# Altium schematic sheet Sheet3.SchDoc
size A3; SPICEModelCacheKOLHZRAH: <root> / <DocumentId>KOLHZRAH</DocumentId> / </root>
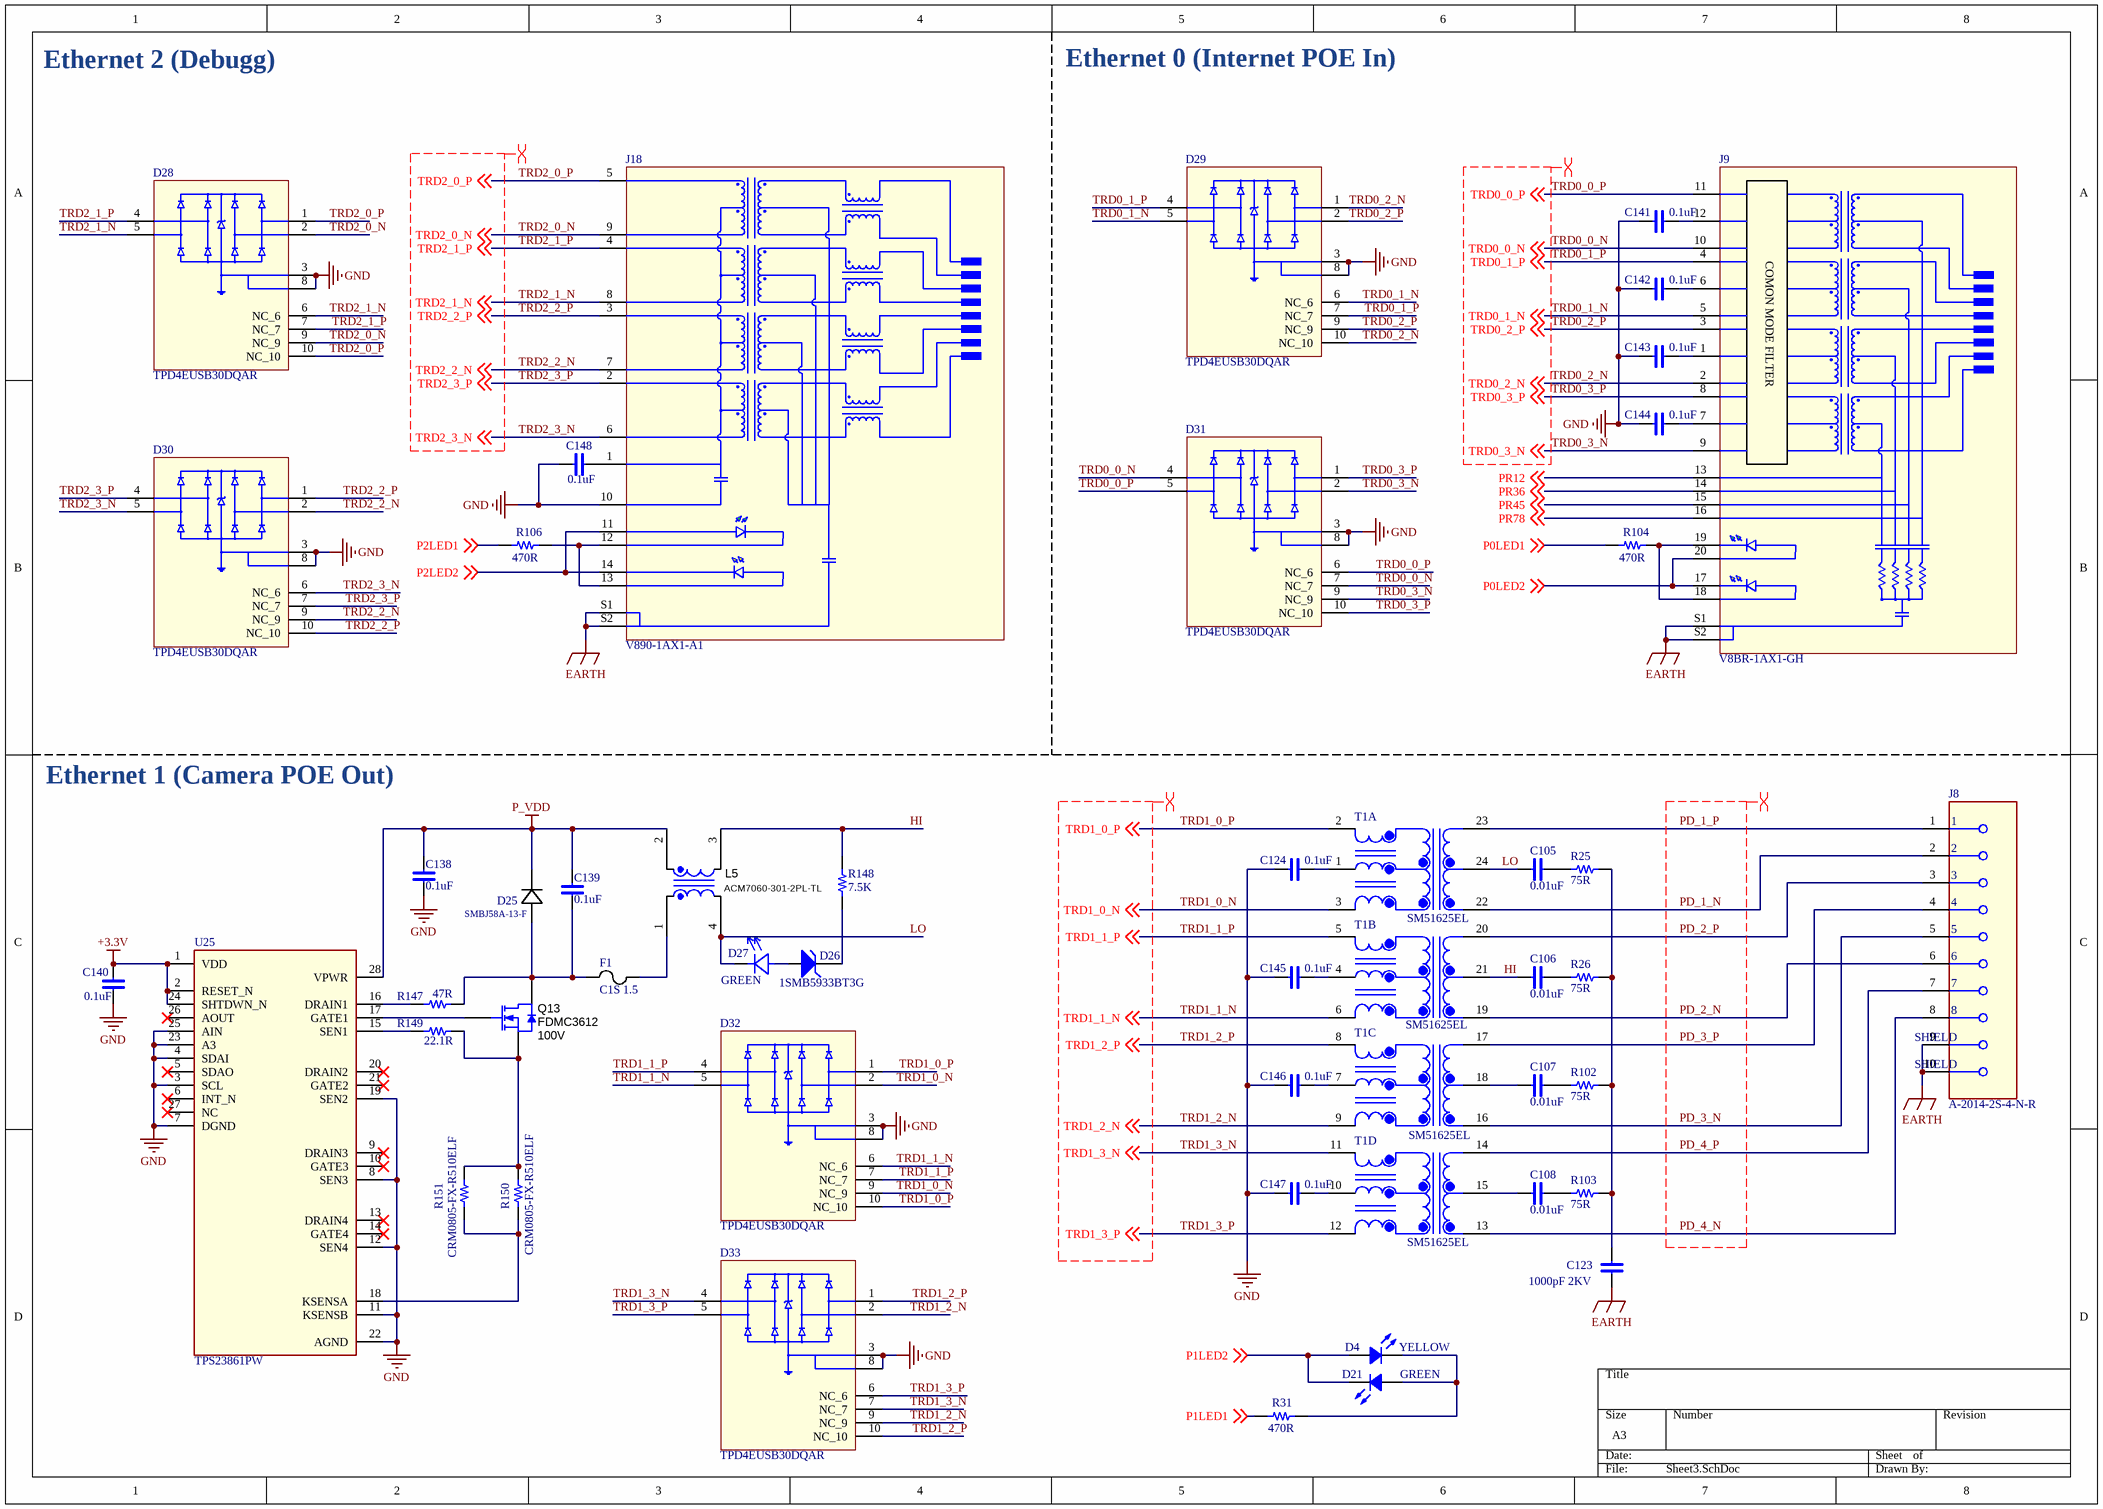
[diagram p0: Sheet3.SchDoc]

## Parts
C105  0.01uF  [C-0402/1005]
C106  0.01uF  [C-0402/1005]
C107  0.01uF  [C-0402/1005]
C108  0.01uF  [C-0402/1005]
C123  1000pF 2KV  [C-0402/1005]
C124  0.1uF  [C-0402/1005]
C138  0.1uF  [C-0402/1005]
C139  0.1uF  [C-0402/1005]
C140  0.1uF  [C-0402/1005]
C141  0.1uF  [C-0402/1005]
C142  0.1uF  [C-0402/1005]
C143  0.1uF  [C-0402/1005]
C144  0.1uF  [C-0402/1005]
C145  0.1uF  [C-0402/1005]
C146  0.1uF  [C-0402/1005]
C147  0.1uF  [C-0402/1005]
C148  0.1uF  [C-0402/1005]
D4  YELLOW  [LED-0603-RED]
D21  GREEN  [LED-0603-RED]
D25  SMBJ58A-13-F  [CR_SM12CA-13-F_DIO]
D26  1SMB5933BT3G  [ONSC-SMB-2-403A-03_H_V]
D27  GREEN  [LED-0603-Green]
D28  TPD4EUSB30DQAR  [IC_TPD4EUSB30DQAR]
D29  TPD4EUSB30DQAR  [IC_TPD4EUSB30DQAR]
D30  TPD4EUSB30DQAR  [IC_TPD4EUSB30DQAR]
D31  TPD4EUSB30DQAR  [IC_TPD4EUSB30DQAR]
D32  TPD4EUSB30DQAR  [IC_TPD4EUSB30DQAR]
D33  TPD4EUSB30DQAR  [IC_TPD4EUSB30DQAR]
F1  C1S 1.5  [C1_BEL]
J8  A-2014-2S-4-N-R  [ASSMANN_A-2014-2S-4-N-R]
J9  V8BR-1AX1-GH  [V8BR1AX1GH]
J18  V890-1AX1-A1  [BEL_V890-1AX1-A1]
L5  ACM7060-301-2PL-TL  [IND_ACM7060_TDK]
Q13  FDMC3612  value 100V  [MLP8_3P3X3P3_ONS]
R25  75R  [R-0402/1005]
R26  75R  [R-0402/1005]
R31  470R  [R-0402/1005]
R102  75R  [R-0402/1005]
R103  75R  [R-0402/1005]
R104  470R  [R-0402/1005]
R106  470R  [R-0402/1005]
R147  47R  [R-0402/1005]
R148  7.5K  [R-0805/2012]
R149  22.1R  [R-0402/1005]
R150  CRM0805-FX-R510ELF  [R-0805/2012]
R151  CRM0805-FX-R510ELF  [R-0805/2012]
T1  SM51625EL  [XFMR_SM51625EL]  (parts A,B,C,D of 4)
U25  TPS23861PW  [PW0028A_N]

## Nets
+3.3V: C140.1 U25.1(VDD) U25.2(RESET_N) U25.24(SHTDWN_N)
EARTH: C123.2 J8.9(MNT_1) J8.10(MNT_2) J9.S1(SHIELD) J9.S2(SHIELD) J18.S1(SHIELD) J18.S2(SHIELD)
GND: C124.1 C138.2 C140.2 C141.1 C142.1 C143.1 C144.1 C145.1 C146.1 C147.1 C148.1 D28.3(GND_3) D28.8(GND_8) D29.3(GND_3) D29.8(GND_8) D30.3(GND_3) D30.8(GND_8) D31.3(GND_3) D31.8(GND_8) D32.3(GND_3) D32.8(GND_8) D33.3(GND_3) D33.8(GND_8) J18.10(GND) U25.3(SCL) U25.4(SDAI) U25.7(DGND) U25.8(SEN3) U25.11(KSENSB) U25.12(SEN4) U25.19(SEN2) U25.22(AGND) U25.23(A3) U25.25(AIN)
P_VDD: C138.1 C139.1 D25.1 L5.2 U25.28(VPWR)
HI: C106.1 L5.3 R148.2 T1.21(MCT2)
LO: C105.1 D27.2 L5.4 T1.24(MCT1)
P0LED1: R104.1 ; off-sheet P0LED1
P0LED2: J9.17 J9.20 ; off-sheet P0LED2
P1LED1: R31.1 ; off-sheet P1LED1
P1LED2: D4.1 D21.2 ; off-sheet P1LED2
P2LED1: R106.1 ; off-sheet P2LED1
P2LED2: J18.11 J18.14 ; off-sheet P2LED2
PD_1_N: J8.2 T1.22(MX1-)
PD_1_P: J8.1 T1.23(MX1+)
PD_2_N: J8.6 T1.19(MX2-)
PD_2_P: J8.3 T1.20(MX2+)
PD_3_N: J8.5 T1.16(MX3-)
PD_3_P: J8.4 T1.17(MX3+)
PD_4_N: J8.8 T1.13(MX4-)
PD_4_P: J8.7 T1.14(MX4+)
PR12: J9.13(VC12) ; off-sheet PR12
PR36: J9.14(VC36) ; off-sheet PR36
PR45: J9.15(VC45) ; off-sheet PR45
PR78: J9.16(VC78) ; off-sheet PR78
TRD0_0_N: D31.4(D2+) D31.7(NC_7) J9.10(TRD1-) ; off-sheet TRD0_0_N
TRD0_0_P: D31.5(D2-) D31.6(NC_6) J9.11(TRD1+) ; off-sheet TRD0_0_P
TRD0_1_N: D29.5(D2-) D29.6(NC_6) J9.5(TRD2-) ; off-sheet TRD0_1_N
TRD0_1_P: D29.4(D2+) D29.7(NC_7) J9.4(TRD2+) ; off-sheet TRD0_1_P
TRD0_2_N: D29.1(D1+) D29.10(NC_10) J9.2(TRD3-) ; off-sheet TRD0_2_N
TRD0_2_P: D29.2(D1-) D29.9(NC_9) J9.3(TRD3+) ; off-sheet TRD0_2_P
TRD0_3_N: D31.2(D1-) D31.9(NC_9) J9.9(TRD4-) ; off-sheet TRD0_3_N
TRD0_3_P: D31.1(D1+) D31.10(NC_10) J9.8(TRD4+) ; off-sheet TRD0_3_P
TRD1_0_N: D32.2(D1-) D32.9(NC_9) T1.3(TD1-) ; off-sheet TRD1_0_N
TRD1_0_P: D32.1(D1+) D32.10(NC_10) T1.2(TD1+) ; off-sheet TRD1_0_P
TRD1_1_N: D32.5(D2-) D32.6(NC_6) T1.6(TD2-) ; off-sheet TRD1_1_N
TRD1_1_P: D32.4(D2+) D32.7(NC_7) T1.5(TD2+) ; off-sheet TRD1_1_P
TRD1_2_N: D33.2(D1-) D33.9(NC_9) T1.9(TD3-) ; off-sheet TRD1_2_N
TRD1_2_P: D33.1(D1+) D33.10(NC_10) T1.8(TD3+) ; off-sheet TRD1_2_P
TRD1_3_N: D33.4(D2+) D33.7(NC_7) T1.11(TD4+) ; off-sheet TRD1_3_N
TRD1_3_P: D33.5(D2-) D33.6(NC_6) T1.12(TD4-) ; off-sheet TRD1_3_P
TRD2_0_N: D28.2(D1-) D28.9(NC_9) J18.9(TRD1-) ; off-sheet TRD2_0_N
TRD2_0_P: D28.1(D1+) D28.10(NC_10) J18.5(TRD1+) ; off-sheet TRD2_0_P
TRD2_1_N: D28.5(D2-) D28.6(NC_6) J18.8(TRD2-) ; off-sheet TRD2_1_N
TRD2_1_P: D28.4(D2+) D28.7(NC_7) J18.4(TRD2+) ; off-sheet TRD2_1_P
TRD2_2_N: D30.2(D1-) D30.9(NC_9) J18.7(TRD3-) ; off-sheet TRD2_2_N
TRD2_2_P: D30.1(D1+) D30.10(NC_10) J18.3(TRD3+) ; off-sheet TRD2_2_P
TRD2_3_N: D30.5(D2-) D30.6(NC_6) J18.6(TRD4-) ; off-sheet TRD2_3_N
TRD2_3_P: D30.4(D2+) D30.7(NC_7) J18.2(TRD4+) ; off-sheet TRD2_3_P
NetC105_2: C105.2 R25.1
NetC106_2: C106.2 R26.1
NetC107_1: C107.1 T1.18(MCT3)
NetC107_2: C107.2 R102.1
NetC108_1: C108.1 T1.15(MCT4)
NetC108_2: C108.2 R103.1
NetC123_1: C123.1 R25.2 R26.2 R102.2 R103.2
NetC124_2: C124.2 T1.1(TCT1)
NetC139_2: C139.2 D25.2 F1.1 Q13.5(D) R147.2
NetC141_2: C141.2 J9.12(TRCT1)
NetC142_2: C142.2 J9.6(TRCT2)
NetC143_2: C143.2 J9.1(TRCT3)
NetC144_2: C144.2 J9.7(TRCT4)
NetC145_2: C145.2 T1.4(TCT2)
NetC146_2: C146.2 T1.7(TCT3)
NetC147_2: C147.2 T1.10(TCT4)
NetC148_2: C148.2 J18.1(TRDCT1/2/3/4)
NetD4_2: D4.2 D21.1 R31.2
NetD26_1: D26.1(K) R148.1
NetD26_2: D26.2(A) D27.1
NetF1_2: F1.2 L5.1
NetJ9_18: J9.18 J9.19 R104.2
NetJ18_12: J18.12 J18.13 R106.2
NetQ13_1: Q13.1(S) R149.2 R150.2 R151.2
NetQ13_4: Q13.4(G) U25.17(GATE1)
NetR147_1: R147.1 U25.16(DRAIN1)
NetR149_1: R149.1 U25.15(SEN1)
NetR150_1: R150.1 R151.1 U25.18(KSENSA)

Not connected (* = marked no-connect by the designer): U25 5(SDAO)* 6(INT_N)* 9(DRAIN3)* 10(GATE3)* 13(DRAIN4)* 14(GATE4)* 20(DRAIN2)* 21(GATE2)* 26(AOUT)* 27(NC)*

## Layout directives
differential pair; differential pair class 100OHM: PD_1_N, PD_1_P, PD_2_N, PD_2_P, PD_3_N, PD_3_P, PD_4_N, PD_4_P, TRD0_0_N, TRD0_0_P, TRD0_1_N, TRD0_1_P, TRD0_2_N, TRD0_2_P, TRD0_3_N, TRD0_3_P, TRD1_0_N, TRD1_0_P, TRD1_1_N, TRD1_1_P, TRD1_2_N, TRD1_2_P, TRD1_3_N, TRD1_3_P, TRD2_0_N, TRD2_0_P, TRD2_1_N, TRD2_1_P, TRD2_2_N, TRD2_2_P, TRD2_3_N, TRD2_3_P

## Notes on the sheet
- Ethernet 2 (Debugg)
- Ethernet 0 (Internet POE In)
- Ethernet 1 (Camera POE Out)
- (in symbol A-2014-2-4-N-T-R) SHIELD
- (in symbol V8BR-1AX1-GH) COMON MODE FILTER

## Library data of the parts
C105-C108 C123 C124 C138-C148 = Capacitor-NonPolar: CAP CER 0.1UF 50V X7R 0402; Mfr. Part No.: UMK105B7104KV-FR; Value: 100nF; Unit Price (USD): 0.15; Supplier Part No.: 587-3498-1-ND; Supplier: Digikey Electronics
D4 D21 = LED SMD: LED RED CLEAR CHIP SMD R/A; Mfr. Part No.: LTST-S270KRKT; Unit Price (USD): 0.24; Supplier Part No.: 160-1479-1-ND; Supplier: Digikey Electronics
D25 = SMBJ58A-13-F: No Description Available; Mfr_Name: Diodes Inc; Type: DEV; Copyright: Copyright (C) 2023 Ultra Librarian. All rights reserved.; Manufacturer_Part_Number: SMBJ58A-13-F; RefDes: RefDes
D26 = CMP-1060-00149-1: 3 W Zener Voltage Regulator, 2-Pin SMB, Pb-Free, Tape and Reel; Manufacturer: On Semiconductor; VZ Typ (V): 22; RoHS: Pb-Free; ComponentLink1Description: Manufacturer URL; PackageDescription: 2-Pin Small Molded Package, J-Bend Lead, Body 4.33 x 3.625 mm; Packing: Tape and Reel; PartNumber: 1SMB5933BT3G; Mounting Technology: Surface Mount; ComponentLink3URL: http://www.onsemi.com/pub_link/Collateral/1SMB5913BT3-D.PDF; PackageReference: SMB-2-403A-03_H; ComponentLink2URL: http://www.onsemi.com/pub_link/Collateral/1SMB5913BT3-D.PDF; ComponentLink2Description: Datasheet; DatasheetVersion: Rev. 8; ComponentLink3Description: Package Specification; ComponentLink1URL: http://www.onsemi.com/; PackageVersion: Rev. H, 05/2011
D27 = Diode-LED: Supplier: Digikey Electronics
D28-D33 = TPD4EUSB30DQAR: 4-channel ESD solution for SuperSpeed (6 Gbps) USB 3.0 interface 10-USON -40 to 85; Value: *; Package: None; MP: TPD4EUSB30DQAR; Price: None; Availability: Unavailable
F1 = C1S 1.5: No Description Available; Mfr_Name: Belfuse; Type: DEV; Copyright: Copyright (C) 2023 Ultra Librarian. All rights reserved.; Manufacturer_Part_Number: C1S 1.5; RefDes: RefDes
J8 = A-2014-2-4-N-T-R: Jack Modular Connector 8p8c (RJ45, Ethernet) Vertical Unshielded; MF: ASSMANN WSW Components; MP: A-2014-2-4-N-T-R; Purchase-URL: https://pricing.snapeda.com/search/part/A-2014-2-4-N-T-R/?ref=eda; SnapEDA_Link: https://www.snapeda.com/parts/A-2014-2-4-N-T-R/ASSMANN%20WSW%20Components/view-part/899781/?ref=snap; Package: None; Value: *; Digi-Key_Part_Number: AE10396-ND
J9 = V8BR-1AX1-GH: Conn RJ-45 F 8 POS 1.02mm Solder ST Thru-Hole 20 Terminal 1 Port Tray; Manufacturer_Name: Bel Magnetic Solutions; Geometry.Height: 17.02mm; Manufacturer_Part_Number: V8BR-1AX1-GH; Mouser Part Number: 530-V8BR-1AX1-GH; Mouser Price/Stock: https://www.mouser.co.uk/ProductDetail/Bel-Magnetic-Solutions/V8BR-1AX1-GH?qs=DPoM0jnrROWshWkc%2FQR6HQ%3D%3D; Arrow Part Number: *; Arrow Price/Stock: *; Datasheet Link: https://belfuse.com/resources/drawings/magneticsolutions/dr-MAG-V8BR-1AX1-GH.pdf
J18 = V890-1AX1-A1: MagJack 1000BaseT | 1X1 | G/Y | Vertical | RoHS; MF: Bel Magnetic Solutions; Value: *; Mouser-Purchase-URL: https://snapeda.com/shop?store=Mouser&id=423023; Package: None; Digi-Key_Part_Number: V890-1AX1-A1A-ND; MP: V890-1AX1-A1; SnapEDA_Link: https://www.snapeda.com/parts/V890-1AX1-A1/Bel%20Magnetic%20Solutions/view-part/423023/?ref=snap
L5 = ACM7060-301-2PL-TL: Coupled inductor, 5A, 0.01 ohm, SMD; Manufacturer: TDK; SymbolCreator: a0799628; Config: Common Chokes; Value: uH; DCR_Ohm: 0.01; Isat: 5; U/M: EA; SymbolVersion: 2013-03-27; ComponentName: ACM7060-301-2PL-TL; PartNumber: ACM7060-301-2PL-TL; Supplier 1: Digi-Key; Supplier Part Number 1: 445-2214-1-ND; PackageReference: 6x3.5x7 mm; MountType: SMT; RoHS: Y; CompType: Coupled Inductor; Published: 2008-05-16; LatestRevisionDate: 2013-10-29; Publisher: Texas Instruments; ComponentLink1Description: Datasheet link; ComponentLink1URL: http://www.tdk.co.jp/tefe02/e9713_acm.pdf
Q13 = FDMC3612: MOSFET, N-CH, 100V, 3.3A, 3.3x1x3.3mm; Manufacturer: Fairchild Semiconductor; Alternate Manufacturer: None; U/M: EA; ChType: N; VdsMax_V: 100; Value1: 0.11 ohm; Rdson45_Ohm: 0.11; Value2: 21 nC; QgTyp_nC: 21; Vgs_V: 4; IdsMax_A: 3.3; SymbolVersion: 2008-07-09; CompType: MOSFET; PartNumber: FDMC3612; PackageReference: 3.3x1x3.3mm; RoHS: Y; MountType: SMT; Published: 2008-06-19; Publisher: Texas Instruments; LatestRevisionDate: 2013-08-15; LatestRevisionNote: Added parts.; ComponentLink1Description: Datasheet link; ComponentLink1URL: http://www.fairchildsemi.com/ds/FD/FDMC3612.pdf; Supplier 1: Digi-Key; Supplier Part Number 1: FDMC3612CT-ND; Supplier 2: Mouser; Supplier Part Number 2: 512-FDMC3612; Supplier 3: Farnell; Supplier Part Number 3: 2083247
R25 R26 R31 R102-R104 R106 R147-R151 = Resistor: RES SMD 51 OHM 0.5% 1/16W 0402; Mfr. Part No.: ERA-2AED510X; Value: 51R; Unit Price (USD): 0.21; Supplier Part No.: P51DECT-ND; Supplier: Digikey Electronics
T1 = 7490220122: 350ÂµH LAN 10/100/1000 Base-T Pulse Transformer 1CT:1CT Transmitter, 1CT:1CT Receiver Surface Mount; MF: Wurth Electronics; SnapEDA_Link: https://www.snapeda.com/parts/7490220122/Wurth%20Electronics%20Inc./view-part/1426413/?ref=snap; Availability: Unavailable; Value: *; MP: 7490220122; Package: SMD-2 Wurth Electronics; Price: None
U25 = TPS23861PW: No Description Available; Mfr_Name: Texas Instruments; Type: DEV; RefDes: RefDes; Copyright: Copyright (C) 2023 Ultra Librarian. All rights reserved.; Manufacturer_Part_Number: TPS23861PW